# Altium schematic sheet Power-Sheet.SchDoc
size A; DocumentNumber: 2; SheetNumber: 2; SheetTotal: 5
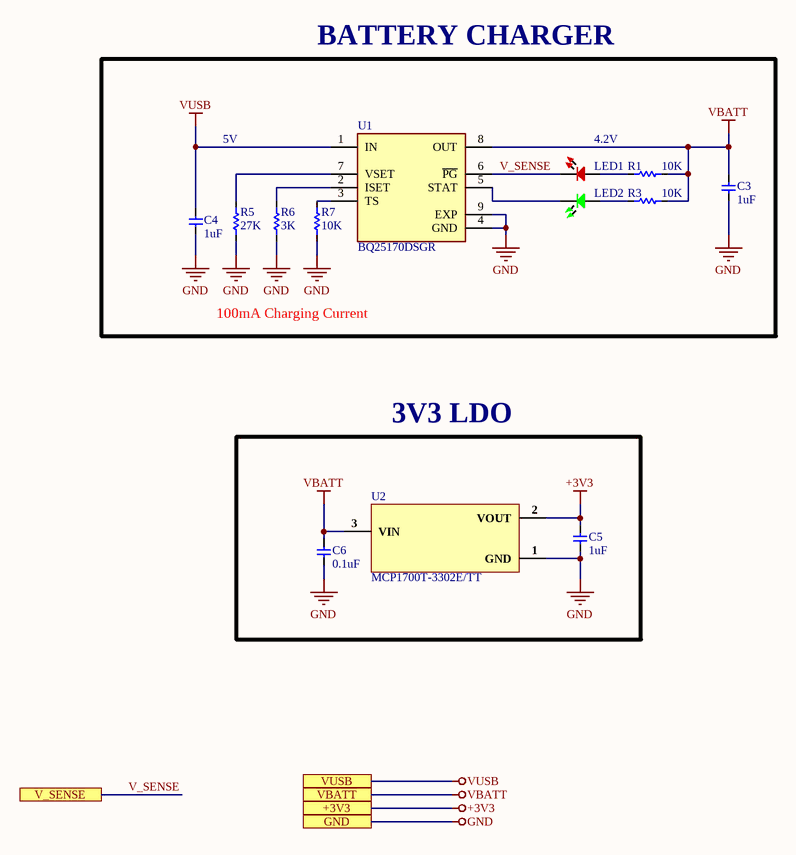
[diagram p0: Power-Sheet.SchDoc]

## Parts
C3  1uF  [Cap-0402]
C4  1uF  [Cap-0402]
C5  1uF  [Cap-0402]
C6  0.1uF  [Cap-0402]
LED1  RED  [LED-0603]  (value not drawn)  (no BOM)
LED2  Emerald  [LED-0603]  (value not drawn)  (no BOM)
R1  10K  [Res-0402]  (no BOM)
R3  10K  [Res-0402]  (no BOM)
R5  27K  [Res-0402]
R6  3K  [Res-0402]
R7  10K  [Res-0402]
U1  BQ25170DSGR  [BQ25170DSGR]
U2  MCP1700T-3302E/TT  [SOT-23]

## Blocks framed on the sheet
BATTERY CHARGER: C3 C4 LED1 LED2 R1 R3 R5-R7 U1
3V3 LDO: C5 C6 U2

## Ports
+3V3 (see Top-Sheet[1B], Connector-Sheet[2D], Controller-Sheet[2D], LED-Driver-Sheet[2D]), GND (see Top-Sheet[1B], Connector-Sheet[2D], Controller-Sheet[2D], LED-Driver-Sheet[2D]), V_SENSE (see Top-Sheet[2B], Controller-Sheet[1D]), VBATT (see Top-Sheet[1B], Connector-Sheet[2D], Controller-Sheet[2D], LED-Driver-Sheet[2D]), VUSB (see Top-Sheet[1B], Connector-Sheet[2D])

## Nets
+3V3: C5.2 U2.2(VOUT) ; port +3V3
GND: C3.1 C4.1 C5.1 C6.1 R5.1 R6.1 R7.1 U1.4(GND) U1.9(EXP) U2.1(GND) ; port GND
VBATT: C3.2 C6.2 R1.1 R3.1 U1.8(OUT) U2.3(VIN) ; port VBATT
VUSB: C4.2 U1.1(IN) ; port VUSB
V_SENSE: LED1.2 U1.6(~{PG}) ; port V_SENSE
NetLED1_1: LED1.1 R1.2
NetLED2_1: LED2.1 R3.2
NetLED2_2: LED2.2 U1.5(STAT)
NetR5_2: R5.2 U1.7(VSET)
NetR6_2: R6.2 U1.2(ISET)
NetR7_2: R7.2 U1.3(TS)

## Notes on the sheet
- 5V
- 4.2V
- 100mA Charging Current

## Library data of the parts
C3-C5 = GRM033R60J105MEA2D: 1 µF ±20% 6.3V Ceramic Capacitor X5R 0201 (0603 Metric); Manufacturer: Murata Electronics; Manufacturer Part Number: GRM033R60J105MEA2D; Digikey Part Number: 490-7229-6-ND; Item Type: Capacitor; Package: 0201; ComponentLink1Description: Digikey Link; ComponentLink1URL: https://www.digikey.com/en/products/detail/murata-electronics/GRM033R60J105MEA2D/4213369
C6 = GRM155R71C104KA88J: 0.1 µF ±10% 16V Ceramic Capacitor X7R 0402 (1005 Metric); Manufacturer: Murata Electronics; Manufacturer Part Number: GRM155R71C104KA88J; Digikey Part Number: 490-6328-6-ND; Item Type: Capacitor; Package: 0402; ComponentLink1Description: Digikey Link; ComponentLink1URL: https://www.digikey.com/en/products/detail/murata-electronics/GRM155R71C104KA88J/2610892
LED1 = NCD0603R3: RED LED 0603 Light Emitting Diodes; Manufacturer: Foshan NationStar Optoelectronics; Manufacturer Part Number: NCD0603R3; Package: 0603; Item Type: LED; LCSC Part Number: C3151730; ComponentLink1Description: LCSC; ComponentLink1URL: https://www.lcsc.com/product-detail/Light-Emitting-Diodes-LED_Foshan-NationStar-Optoelectronics-NCD0603R3_C3151730.html
LED2 = NCD0603G2: Emerald 0603 Light Emitting Diodes (LED) ROHS; Manufacturer: Foshan NationStar Optoelectronics; Manufacturer Part Number: NCD0603G2; Package: 0603; LCSC Part Number: C87326; Item Type: LED; ComponentLink1Description: LCSC; ComponentLink1URL: https://www.lcsc.com/product-detail/Light-Emitting-Diodes-LED_Foshan-NationStar-Optoelectronics-NCD0603G2_C87326.html
R1 R3 R7 = RC0603FR-0710KL: 10 kOhms ±1% 0.063W, 1/16W Chip Resistor 0402 (1005 Metric) Moisture Resistant Thick Film; Manufacturer: YAGEO; Manufacturer Part Number: RC0402FR-0710KL; Digikey Part Number: 311-10.0KLRDKR-ND; Item Type: Resistor; Package: 0402; ComponentLink1Description: Digikey Link; ComponentLink1URL: https://www.digikey.com/en/products/detail/yageo/RC0402FR-0710KL/726523
R5 = RC0402FR-0727KL: 27 kOhms ±1% 0.063W, 1/16W Chip Resistor 0402 (1005 Metric) Moisture Resistant Thick Film; Manufacturer: YAGEO; Manufacturer Part Number: RC0402FR-0727KL; ComponentLink1Description: New link; ComponentLink1URL: *; Digikey Part Number: 311-27.0KLRDKR-ND; Item Type: Resistor; Package: 0402
R6 = RC0402FR-073KL: 3 kOhms ±1% 0.063W, 1/16W Chip Resistor 0402 (1005 Metric) Moisture Resistant Thick Film; Manufacturer: YAGEO; Manufacturer Part Number: RC0402FR-073KL; Digikey Part Number: 311-3KLRCT-ND; Item Type: Resistor; Package: 0402; ComponentLink1Description: Digikey Link; ComponentLink1URL: https://www.digikey.com/en/products/detail/yageo/RC0402FR-073KL/2827586
U1 = BQ25170DSGR: Charger IC Multi-Chemistry 8-WSON (2x2); Manufacturer: Texas Instruments; Item Type: BATTERY CHARGER; Manufacturer Part Number: BQ25170DSGR; Digikey Part Number: 296-BQ25170DSGRDKR-ND; Package: 8-WFDFN Exposed Pad; ComponentLink1Description: Digikey Link; ComponentLink1URL: https://www.digikey.com/en/products/detail/texas-instruments/BQ25170DSGR/14124032
U2 = MCP1700T-3302E/TT: IC REG LDO 3.3V 0.25A SOT23-3; Manufacturer: Microchip; Number of Outputs: 1; Min Input Voltage: 2.3V; Max Input Voltage: 6V; Dropout Voltage: 178mV; Output Current: 250mA; Max Power Dissipation: 369.6mW; Input Bias Current: 1.6uA; Polarity: Positive; Quiescent Current: 4uA; Accuracy: 2%; Output Type: Fixed; Supplier 1: Digi-Key; Manufacturer Part Number: MCP1700T-3302E/TT; RoHS: Yes; Category: Voltage Regulators - Linear; Stock 1: 230029; Pricing 1: 1=0.50000, 25=0.42400, 100=0.37500 (USD); Mount: Surface Mount; Case/Package: SOT-23; Number of Pins: 3; Contact Plating: Tin,Matte; Min Operating Temperature: -40°C; Max Operating Temperature: 125°C; Nominal Output Voltage: 3.3V; Packaging: Tape and Reel; Output Voltage: 3.3V; Max Output Current: 250mA; Max Supply Voltage: 6V; Min Supply Voltage: 2.3V; Package Quantity: 3000; Min Output Voltage: 3.3V; Max Output Voltage: 3.3V; Termination: SMD/SMT; Output Voltage Accuracy: 2%; Nominal Supply Current: 4uA; Power Dissipation: 369.6mW; Supply Current: 4uA; Length: 2.9mm; Width: 1.3mm; Height: 0.95mm; Radiation Hardening: No; Reach SVHC Compliant: No SVHC; Lead Free: Lead Free; RoHS Compliant: Yes; ComponentLink1URL: https://datasheet.ciiva.com/5801/1784514-5801824.pdf?src-supplier=Farnell; ComponentLink1Description: https://datasheet.ciiva.com/5801/1784514-5801824.pdf?src-supplier=Farnell; ComponentLink2URL: https://datasheet.ciiva.com/2040/21826b-2040112.pdf?src-supplier=Digi-Key; ComponentLink2Description: https://datasheet.ciiva.com/2040/21826b-2040112.pdf?src-supplier=Digi-Key; ComponentLink3URL: https://datasheet.ciiva.com/7649/1784514-7649813.pdf?src-supplier=Element14; ComponentLink3Description: https://datasheet.ciiva.com/7649/1784514-7649813.pdf?src-supplier=Element14; ComponentLink4URL: https://datasheet.ciiva.com/22710/1784514-22710988.pdf?src-supplier=Element14; ComponentLink4Description: https://datasheet.ciiva.com/22710/1784514-22710988.pdf?src-supplier=Element14; ComponentLink5URL: https://datasheet.ciiva.com/14150/mcp1700-eng-tds-14150122.pdf?src-supplier=Distrelec; ComponentLink5Description: https://datasheet.ciiva.com/14150/mcp1700-eng-tds-14150122.pdf?src-supplier=Distrelec; ComponentLink6URL: https://datasheet.ciiva.com/8041/1784514-8041598.pdf?src-supplier=Element14; ComponentLink6Description: https://datasheet.ciiva.com/8041/1784514-8041598.pdf?src-supplier=Element14; ComponentLink7URL: https://datasheet.ciiva.com/3224/jp011779-3224133.pdf?src-supplier=Avnet; ComponentLink7Description: https://datasheet.ciiva.com/3224/jp011779-3224133.pdf?src-supplier=Avnet; ComponentLink8URL: https://datasheet.ciiva.com/16208/filehandler-aspxddocname-en011779-16208911.pdf?src-supplier=Future+Electronics; ComponentLink8Description: https://datasheet.ciiva.com/16208/filehandler-aspxddocname-en011779-16208911.pdf?src-supplier=Future+Electronics; ComponentLink9URL: https://datasheet.ciiva.com/15200/getdatasheetpartid-453599-15200229.pdf?src-supplier=Verical; ComponentLink9Description: https://datasheet.ciiva.com/15200/getdatasheetpartid-453599-15200229.pdf?src-supplier=Verical; ComponentLink10URL: https://datasheet.ciiva.com/2040/21826b-2040113.pdf?src-supplier=Digi-Key; ComponentLink10Description: https://datasheet.ciiva.com/2040/21826b-2040113.pdf?src-supplier=Digi-Key; ComponentLink11URL: https://datasheet.ciiva.com/2040/21826b-2040114.pdf?src-supplier=Digi-Key; ComponentLink11Description: https://datasheet.ciiva.com/2040/21826b-2040114.pdf?src-supplier=Digi-Key; ComponentLink12URL: https://datasheet.ciiva.com/29305/651414-da-01-en-ic-reg-ld-mcp1700t-3302e-tt-sot-23-3-mcp-29305258.pdf?src-supplier=Conrad; ComponentLink12Description: https://datasheet.ciiva.com/29305/651414-da-01-en-ic-reg-ld-mcp1700t-3302e-tt-sot-23-3-mcp-29305258.pdf?src-supplier=Conrad; Supplier Part Number 1: MCP1700T3302ETTCT-ND; Item Type: IC; Digikey Part Number: MCP1700T3302ETTDKR-ND